# EAGLE schematic node-circuit-board-v0 (EAGLE 8.7.1)
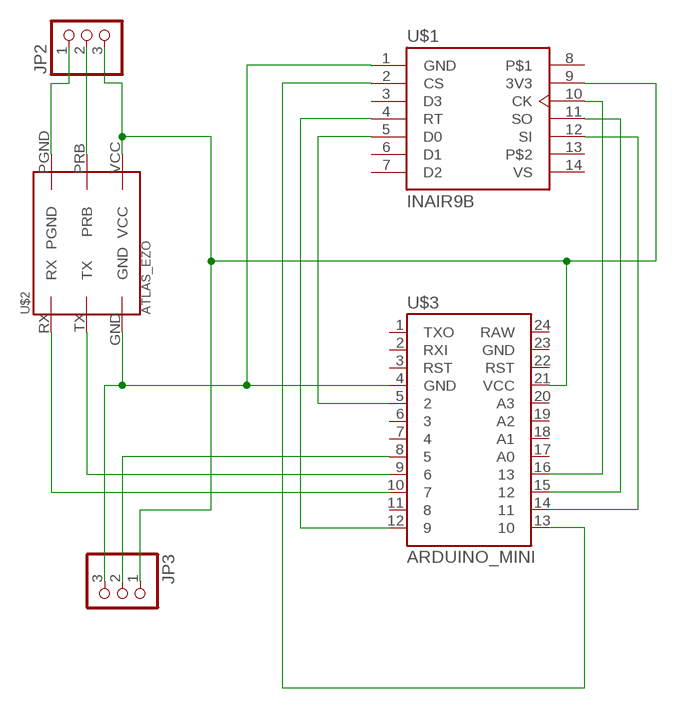
[diagram p0: schematic, sheet 1]

## Parts
JP2  PINHD-1X3CB  [1X03-CLEANBIG]
JP3  PINHD-1X3CB  [1X03-CLEANBIG]
U$1  INAIR9B  [INAIR]
U$2  ATLAS_EZO  [ATLAS_EZO]
U$3  ARDUINO_MINI  [ARDUINO_MINI]

## Nets
N$1: U$1.2(CS) U$3.13
N$2: U$1.4(RT) U$3.12
N$3: U$1.5(D0) U$3.5
N$4: U$1.10(CK) U$3.16
N$5: U$1.11(SO) U$3.15
N$6: U$1.12(SI) U$3.14
N$7: JP3.3 U$1.1(GND) U$2.GND U$3.4(GND)
N$8: U$2.TX U$3.9
N$9: U$2.RX U$3.10
N$10: JP2.1 U$2.PGND
N$11: JP2.3 JP3.1 U$1.9(3V3) U$2.VCC U$3.21(VCC)
N$12: JP2.2 U$2.PRB
N$13: JP3.2 U$3.8
Unconnected: U$1.3(D3) U$1.6(D1) U$1.7(D2) U$1.8 U$1.13 U$1.14(VS) U$3.1(TXO) U$3.2(RXI) U$3.3(RST) U$3.6 U$3.7 U$3.11 U$3.17(A0) U$3.18(A1) U$3.19(A2) U$3.20(A3) U$3.22(RST) U$3.23(GND) U$3.24(RAW)

## Library data of the parts
JP2 JP3 = adafruit:PINHD-1X3: PIN HEADER
U$1 = inair-modules:INAIR9B: Modtronix inAir9B Module - SX1276 LoRa Module, 868MHz and 915MHz, +20dBm, 3.3V, SMA Connector
U$2 = AtlasScientific:ATLAS_EZO: Atlas Scientific EZO Circuit
U$3 = SparkFun-Retired:ARDUINO_MINI: Arduino Pro Mini footprint